# EAGLE design christmas_card (EAGLE 8.4.3)
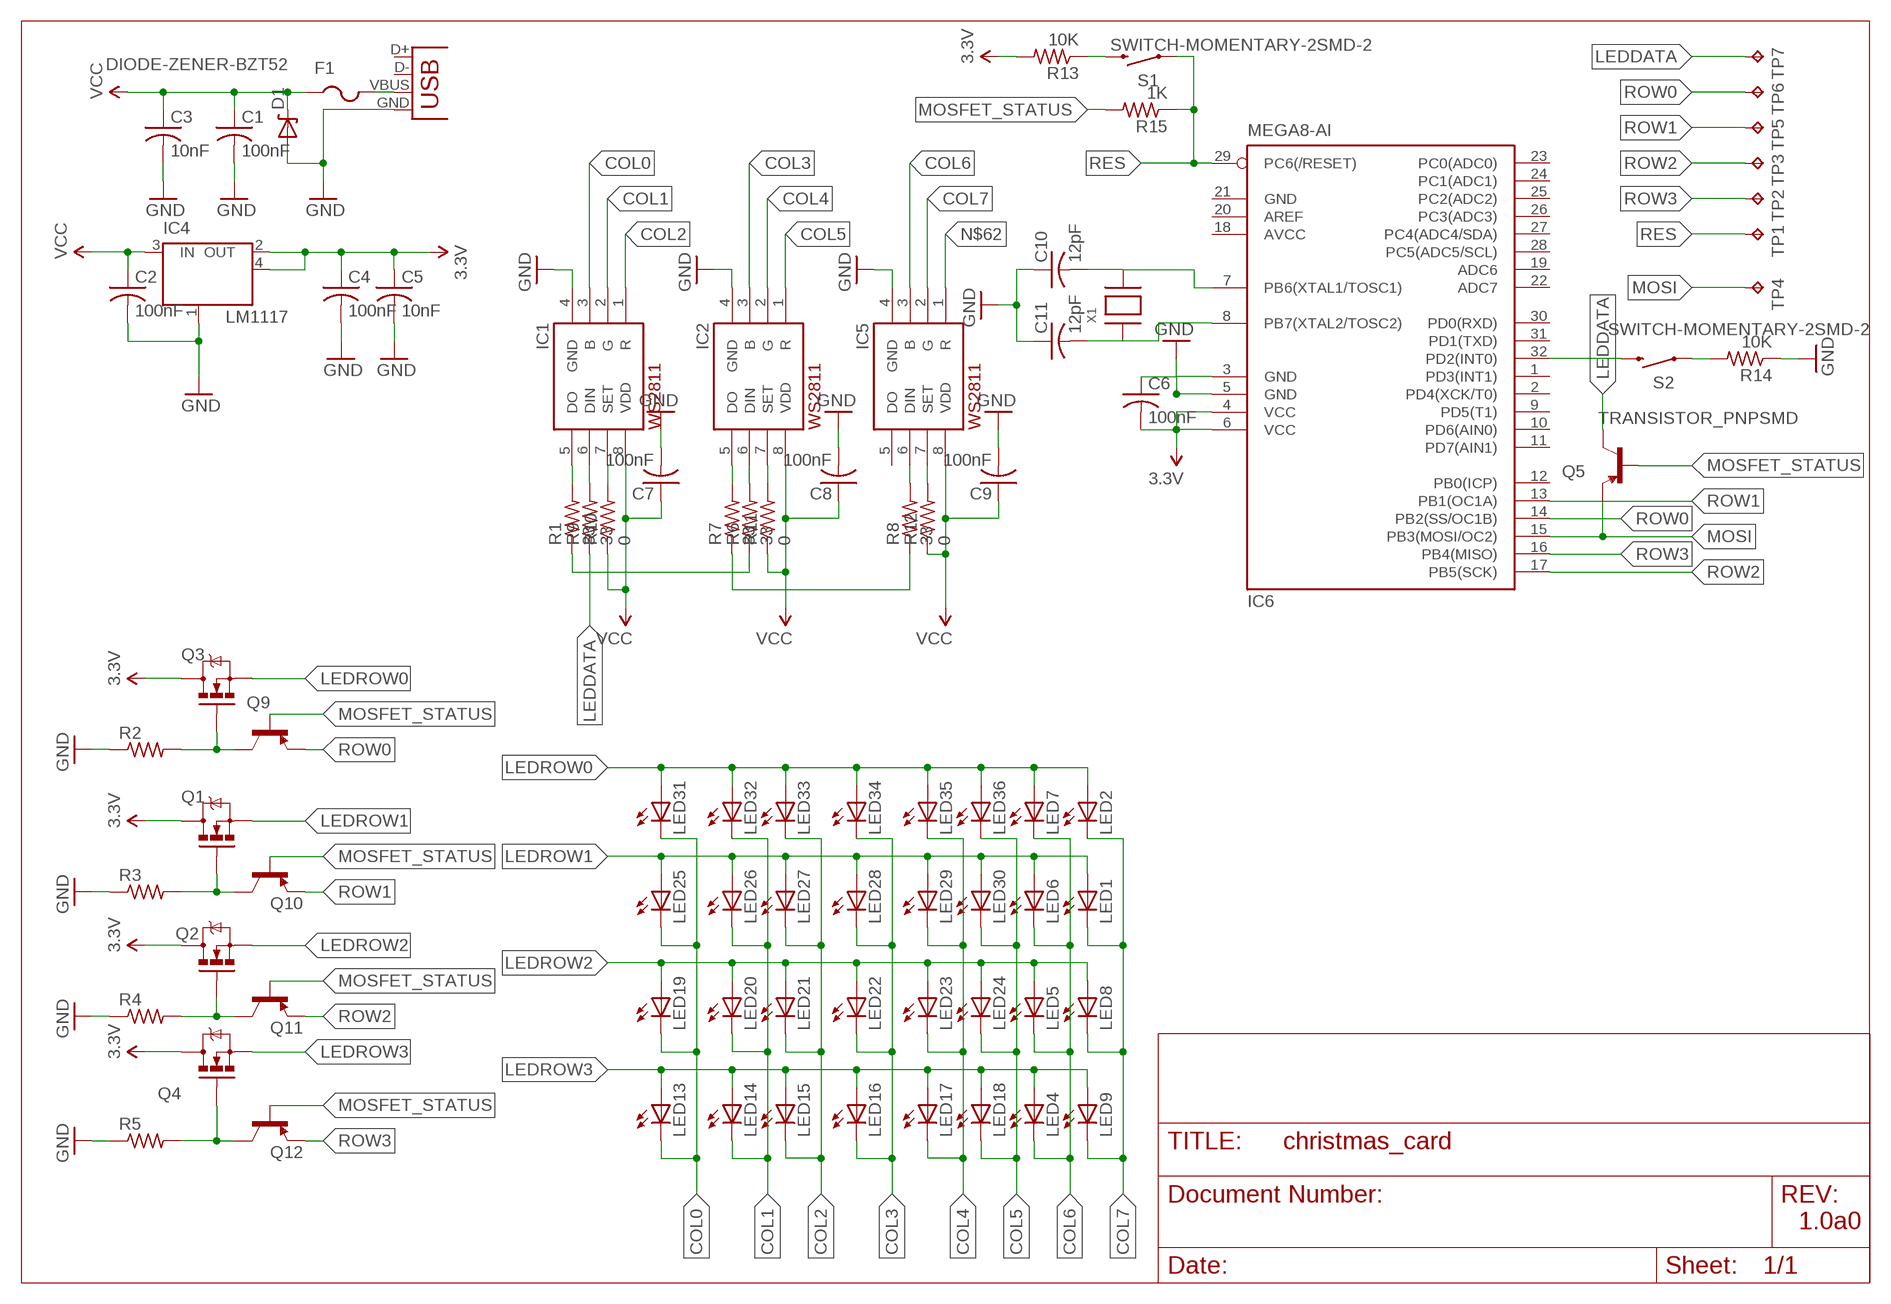
[diagram p0: schematic, sheet 1]

## Parts
C1  100nF  C-USC0603  [C0603]
C2  100nF  C-USC0603  [C0603]
C3  10nF  C-USC0603  [C0603]
C4  100nF  C-USC0603  [C0603]
C5  10nF  C-USC0603  [C0603]
C6  100nF  C-USC0603  [C0603]
C7  100nF  C-USC0603  [C0603]
C8  100nF  C-USC0603  [C0603]
C9  100nF  C-USC0603  [C0603]
C10  12pF  C-USC0603  [C0603]
C11  12pF  C-USC0603  [C0603]
D1  DIODE-ZENER-BZT52  [SOD-323]
F1  PTCFUSE-1206  [R1206]
IC1  WS2811-SOP8  [SO08-SKINNYPADS]
IC2  WS2811-SOP8  [SO08-SKINNYPADS]
IC4  LM1117  [SOT223]
IC5  WS2811-SOP8  [SO08-SKINNYPADS]
IC6  MEGA8-AI  [TQFP32-08]
LED1  LED1206  [LED-1206]
LED2  LED1206  [LED-1206]
LED4  LED1206  [LED-1206]
LED5  LED1206  [LED-1206]
LED6  LED1206  [LED-1206]
LED7  LED1206  [LED-1206]
LED8  LED1206  [LED-1206]
LED9  LED1206  [LED-1206]
LED13  LED1206  [LED-1206]
LED14  LED1206  [LED-1206]
LED15  LED1206  [LED-1206]
LED16  LED1206  [LED-1206]
LED17  LED1206  [LED-1206]
LED18  LED1206  [LED-1206]
LED19  LED1206  [LED-1206]
LED20  LED1206  [LED-1206]
LED21  LED1206  [LED-1206]
LED22  LED1206  [LED-1206]
LED23  LED1206  [LED-1206]
LED24  LED1206  [LED-1206]
LED25  LED1206  [LED-1206]
LED26  LED1206  [LED-1206]
LED27  LED1206  [LED-1206]
LED28  LED1206  [LED-1206]
LED29  LED1206  [LED-1206]
LED30  LED1206  [LED-1206]
LED31  LED1206  [LED-1206]
LED32  LED1206  [LED-1206]
LED33  LED1206  [LED-1206]
LED34  LED1206  [LED-1206]
LED35  LED1206  [LED-1206]
LED36  LED1206  [LED-1206]
Q1  MOSFET-NCHANNELSMD  [SOT23-3]
Q2  MOSFET-NCHANNELSMD  [SOT23-3]
Q3  MOSFET-NCHANNELSMD  [SOT23-3]
Q4  MOSFET-NCHANNELSMD  [SOT23-3]
Q5  TRANSISTOR_PNPSMD  [SOT23-3]
Q9  TRANSISTOR_PNPSMD  [SOT23-3]
Q10  TRANSISTOR_PNPSMD  [SOT23-3]
Q11  TRANSISTOR_PNPSMD  [SOT23-3]
Q12  TRANSISTOR_PNPSMD  [SOT23-3]
R1  33  R-US_R0603  [R0603]
R2  R-US_R0603  [R0603]
R3  R-US_R0603  [R0603]
R4  R-US_R0603  [R0603]
R5  R-US_R0603  [R0603]
R6  33  R-US_R0603  [R0603]
R7  33  R-US_R0603  [R0603]
R8  33  R-US_R0603  [R0603]
R9  33  R-US_R0603  [R0603]
R10  0  R-US_R0603  [R0603]
R11  0  R-US_R0603  [R0603]
R12  0  R-US_R0603  [R0603]
R13  10K  R-US_R0603  [R0603]
R14  10K  R-US_R0603  [R0603]
R15  1K  R-US_R0603  [R0603]
S1  SWITCH-MOMENTARY-2SMD-2  [TACTILE_SWITCH_SMD-2]
S2  SWITCH-MOMENTARY-2SMD-2  [TACTILE_SWITCH_SMD-2]
TP1  TPB1,27  [B1,27]
TP2  TPB1,27  [B1,27]
TP3  TPB1,27  [B1,27]
TP4  TPB1,27  [B1,27]
TP5  TPB1,27  [B1,27]
TP6  TPB1,27  [B1,27]
TP7  TPB1,27  [B1,27]
X1  XTALNX5032  [NX5032]
X2  USB-MICROB  [USB-MICROB]

## Nets
3.3V: C4.1 C5.1 C6.2 IC4.2(OUT) IC4.4(OUT) IC6.4(VCC) IC6.6(VCC) Q1.3(D) Q2.3(D) Q3.3(D) Q4.3(D) R13.2
COL0: IC1.3(B) LED13.C LED19.C LED25.C LED31.C
COL1: IC1.2(G) LED14.C LED20.C LED26.C LED32.C
COL2: IC1.1(R) LED15.C LED21.C LED27.C LED33.C
COL3: IC2.3(B) LED16.C LED22.C LED28.C LED34.C
COL4: IC2.2(G) LED17.C LED23.C LED29.C LED35.C
COL5: IC2.1(R) LED18.C LED24.C LED30.C LED36.C
COL6: IC5.3(B) LED4.C LED5.C LED6.C LED7.C
COL7: IC5.2(G) LED1.C LED2.C LED8.C LED9.C
GND: C1.2 C2.2 C3.2 C4.2 C5.2 C6.1 C7.2 C8.2 C9.2 C10.1 C11.1 D1.2(A) IC1.4(GND) IC2.4(GND) IC4.1(GND/ADJ) IC5.4(GND) IC6.3(GND) IC6.5(GND) R2.1 R3.1 R4.1 R5.1 R14.1 X2.GND
LEDDATA: Q5.3(C) R9.1 TP7.TP
LEDROW0: LED2.A LED7.A LED31.A LED32.A LED33.A LED34.A LED35.A LED36.A Q3.2(S)
LEDROW1: LED1.A LED6.A LED25.A LED26.A LED27.A LED28.A LED29.A LED30.A Q1.2(S)
LEDROW2: LED5.A LED8.A LED19.A LED20.A LED21.A LED22.A LED23.A LED24.A Q2.2(S)
LEDROW3: LED4.A LED9.A LED13.A LED14.A LED15.A LED16.A LED17.A LED18.A Q4.2(S)
MOSFET_STATUS: Q5.1(B) Q9.1(B) Q10.1(B) Q11.1(B) Q12.1(B) R15.2
MOSI: IC6.15(PB3(MOSI/OC2)) Q5.2(E) TP4.TP
N$1: R1.1 R6.1
N$2: IC1.5(DO) R1.2
N$3: IC2.6(DIN) R6.2
N$4: IC2.5(DO) R7.2
N$5: R7.1 R8.1
N$6: IC5.6(DIN) R8.2
N$7: IC1.6(DIN) R9.2
N$8: IC5.7(SET) R12.2
N$9: R13.1 S1.1
N$10: C10.2 IC6.7(PB6(XTAL1/TOSC1)) X1.P$2
N$11: IC6.32(PD2(INT0)) S2.1
N$12: R14.2 S2.2
N$13: Q3.1(G) Q9.3(C) R2.2
N$14: C11.2 IC6.8(PB7(XTAL2/TOSC2)) X1.P$1
N$35: IC2.7(SET) R11.2
N$36: IC1.7(SET) R10.2
N$41: F1.2 X2.VBUS
N$62: IC5.1(R)
RES: IC6.29(PC6(/RESET)) R15.1 S1.2 TP1.TP
ROW0: IC6.14(PB2(SS/OC1B)) Q9.2(E) TP6.TP
ROW1: IC6.13(PB1(OC1A)) Q1.1(G) Q10.2(E) Q10.3(C) R3.2 TP5.TP
ROW2: IC6.17(PB5(SCK)) Q2.1(G) Q11.2(E) Q11.3(C) R4.2 TP3.TP
ROW3: IC6.16(PB4(MISO)) Q4.1(G) Q12.2(E) Q12.3(C) R5.2 TP2.TP
VCC: C1.1 C2.1 C3.1 C7.1 C8.1 C9.1 D1.1(C) F1.1 IC1.8(VDD) IC2.8(VDD) IC4.3(IN) IC5.8(VDD) R10.1 R11.1 R12.1
Unconnected: IC5.5(DO) IC6.1(PD3(INT1)) IC6.2(PD4(XCK/T0)) IC6.9(PD5(T1)) IC6.10(PD6(AIN0)) IC6.11(PD7(AIN1)) IC6.12(PB0(ICP)) IC6.19(ADC6) IC6.20(AREF) IC6.22(ADC7) IC6.23(PC0(ADC0)) IC6.24(PC1(ADC1)) IC6.25(PC2(ADC2)) IC6.26(PC3(ADC3)) IC6.27(PC4(ADC4/SDA)) IC6.28(PC5(ADC5/SCL)) IC6.30(PD0(RXD)) IC6.31(PD1(TXD)) X2.D+ X2.D-

## Notes on the sheet
- 1.0a0

## Power pins joined to a net without a drawn wire
AVCC: IC6.18(AVCC)
GND: IC6.21(GND)

## Library data of the parts
C1-C11 = adafruit:C-US: CAPACITOR, American symbol
D1 = SparkFun:DIODE-ZENER: Zener Diode Production Part - 8199 3.4V Zener Voltage
F1 = adafruit:PTCFUSE: PTC fuses, resettable thermistors
IC1 IC2 IC5 = adafruit:WS2811
IC4 = voltage_regulators:LM1117
IC6 = atmel:MEGA8: MICROCONTROLLER 8 Kbytes FLASH, 1 kbytes SRAM, 512 bytes EEPROM, USART, 6-channel 10 bit ADC, 2-channel 8 bit ADC Pin compatible with Atmega48, ATMega88, ATMega168 Source: avr.lbr; MPN: ATMEGA8-16AU; OC_FARNELL: 9171371; OC_NEWARK: 73M8863
LED1 LED2 LED4-LED9 LED13-LED36 = SparkFun:LED: LEDs Standard schematic elements and footprints for 5mm, 3mm, 1206, and 0603 sized LEDs. 5mm - Spark Fun Electronics SKU : COM-00529 (and others)
Q1-Q4 = SparkFun:MOSFET-NCHANNEL
Q5 Q9-Q12 = SparkFun:TRANSISTOR_PNP
R1-R15 = adafruit:R-US_: RESISTOR, American symbol
S1 S2 = SparkFun:SWITCH-MOMENTARY-2
TP1-TP7 = testpad:TP: Test pad
X1 = adafruit:XTAL: Low cost SMT crystals, no capacitors included http://www.ladyada.net/library/eagle
X2 = SparkFun:USB: USB Connectors USB-B-PTH is fully proven SKU : PRT-00139 USB-miniB is fully proven SKU : PRT-00587 USB-A-PCB is untested. USB-A-H is throughly reviewed, but untested. Spark Fun Electronics SKU : PRT-00437 USB-B-SMT is throughly reviewed, but untested. Needs silkscreen touching up. USB-A-S has not been used/tested USB-MB-H has not been used/tested

## Board
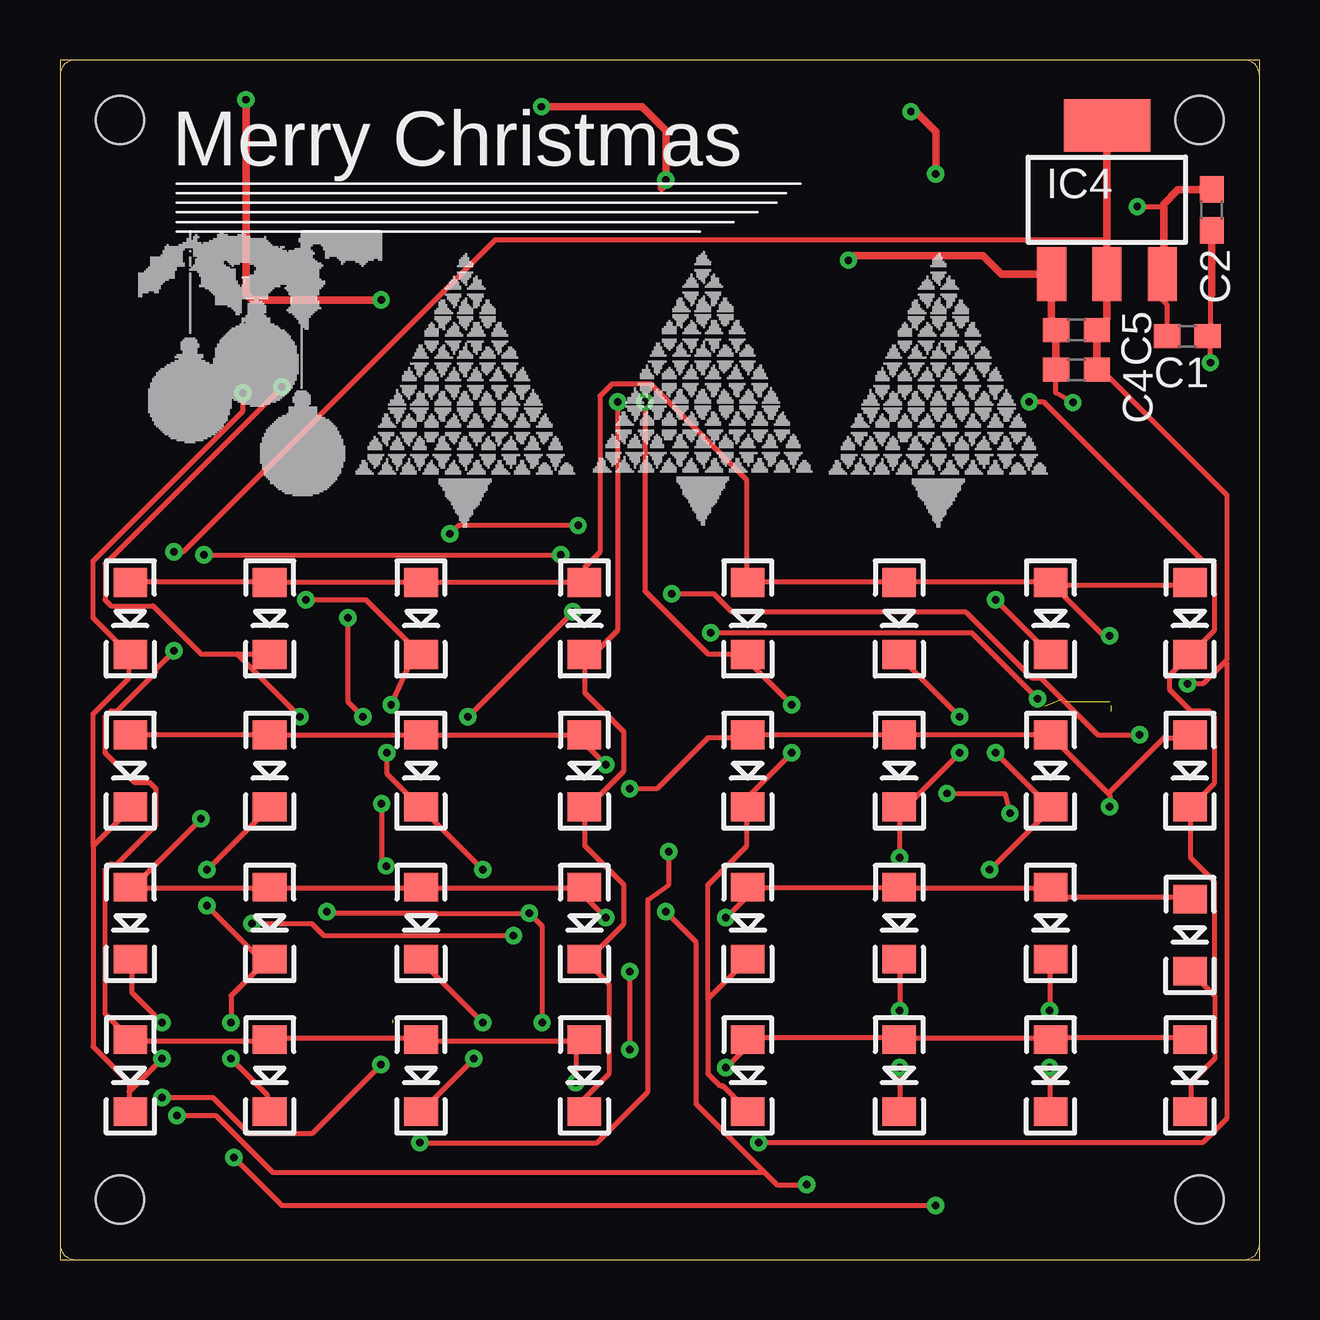
[diagram p1: board, top side]
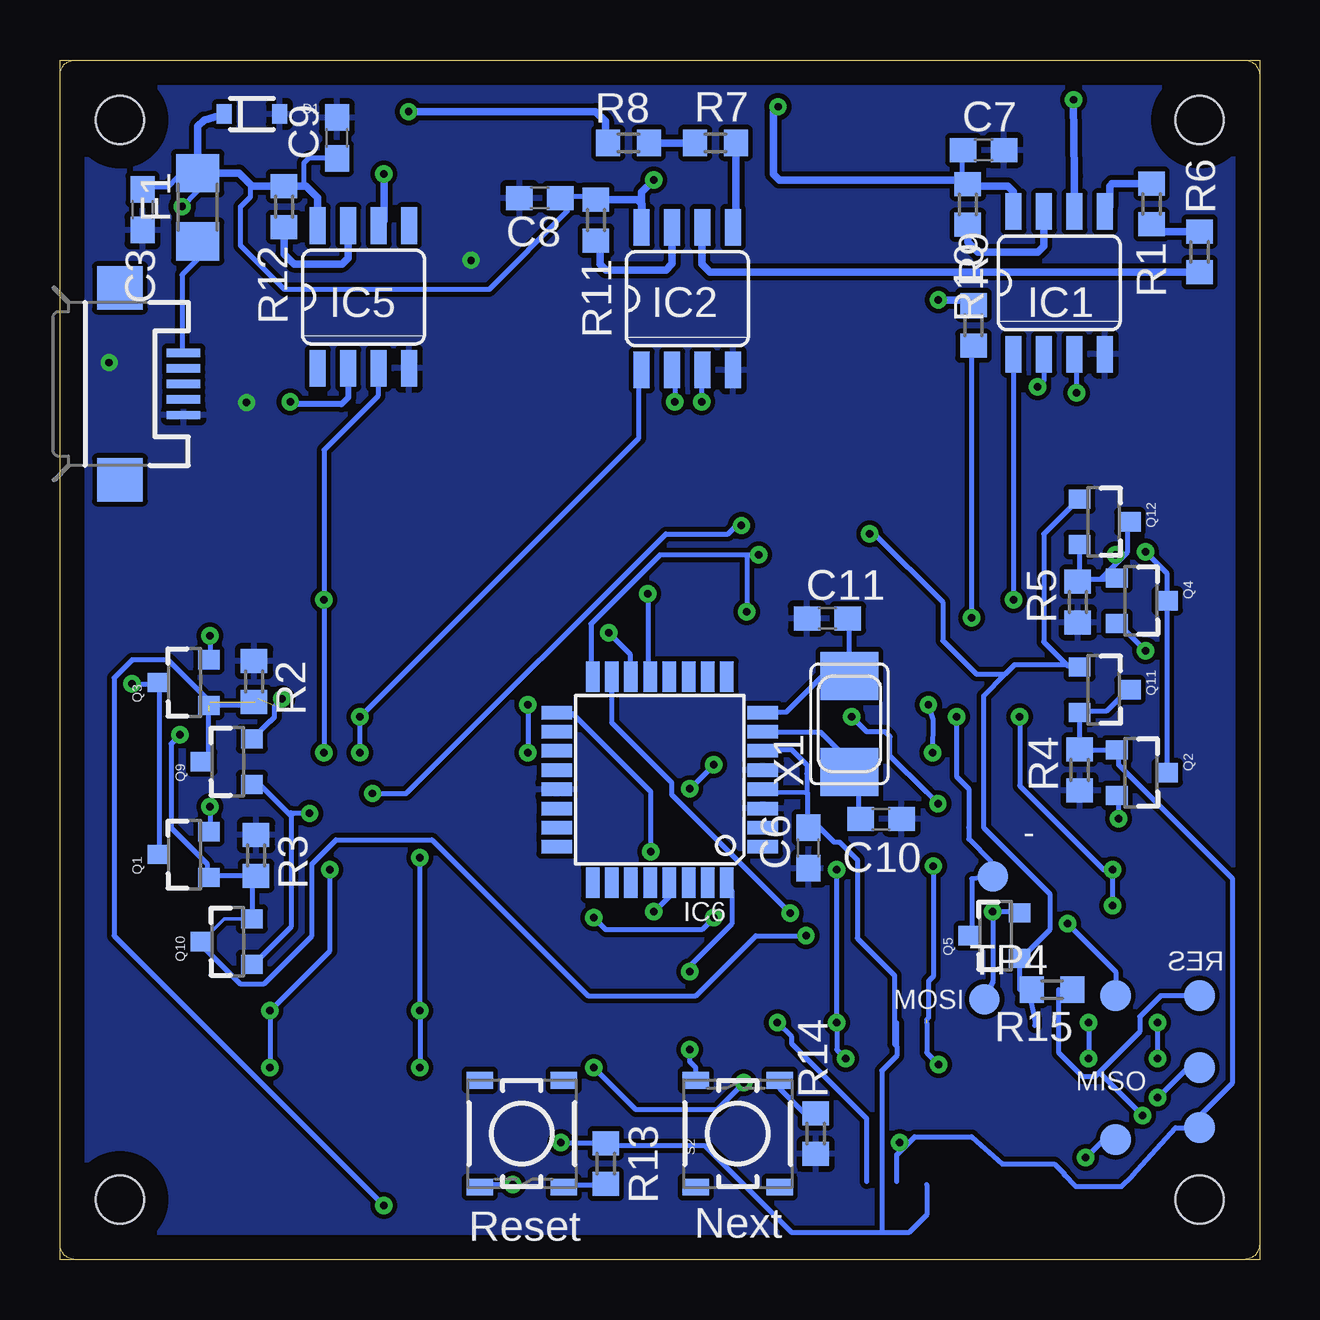
[diagram p2: board, bottom side, seen from below]

Size 50 x 50 mm. Coordinates in mm from the lower left corner, seen from the top.
Outline: 50,0.63 50,49.36 arc90 49.36,50 0.63,50 arc90 0,49.36 0,0.63 arc90 0.63,0 49.36,0 arc90 50,0.63
Outline: 0,0 50,0 50,50 0,50 0,0
Copper layers (1*16): Top 0.035mm / dielectric 1.5mm / Bottom 0.035mm
Design rules "default *": minimum track width 8mil, minimum drill 12mil, track to track 8mil, track to pad 8mil, pad to pad 8mil, via to via 8mil, smd to smd 8mil, copper to edge 40mil, drill to drill 8mil, minimum pad ring 10mil, minimum via ring 8mil, stop-mask expansion 4mil, vias tented up to drill 12mil, thermal gap 10mil
Holes 2 mm at 2.5,2.5 47.5,2.5 47.5,47.5 2.5,47.5

### Footprints (pad centres in the part's own frame; a part is rotated, then mirrored left to right if it is on the bottom)
C0603 = smd 1.1 x 1: 1 -0.85,0; 2 0.85,0
SOD-323 = smd 0.63 x 0.83: 1 -1.15,0; 2 1.15,0
R1206 = smd 1.6 x 1.803: 1 -1.422,0; 2 1.422,0
SO08-SKINNYPADS = smd 0.66 x 1.524: 1 -1.905,-2.973; 2 -0.635,-2.973; 3 0.635,-2.973; 4 1.905,-2.973; 5 1.905,2.973; 6 0.635,2.973; 7 -0.635,2.973; 8 -1.905,2.973
SOT223 = smd 1.219 x 2.235: 1 -2.311,-3.099; 2 0,-3.099; 3 2.311,-3.099 | smd 3.6 x 2.2: 4 0,3.099
TQFP32-08 = smd 1.27 x 0.559: 1 -4.293,2.8; 2 -4.293,2; 3 -4.293,1.2; 4 -4.293,0.4; 5 -4.293,-0.4; 6 -4.293,-1.2; 7 -4.293,-2; 8 -4.293,-2.8; 17 4.293,-2.8; 18 4.293,-2; 19 4.293,-1.2; 20 4.293,-0.4; 21 4.293,0.4; 22 4.293,1.2; 23 4.293,2; 24 4.293,2.8 | smd 0.559 x 1.27: 9 -2.8,-4.293; 10 -2,-4.293; 11 -1.2,-4.293; 12 -0.4,-4.293; 13 0.4,-4.293; 14 1.2,-4.293; 15 2,-4.293; 16 2.8,-4.293; 25 2.8,4.293; 26 2,4.293; 27 1.2,4.293; 28 0.4,4.293; 29 -0.4,4.293; 30 -1.2,4.293; 31 -2,4.293; 32 -2.8,4.293
LED-1206 = smd 1.2 x 1.4: A -1.5,0; C 1.5,0
SOT23-3 = smd 0.8 x 0.9: 1 -0.95,-1; 2 0.95,-1; 3 0,1.1
R0603 = smd 1 x 1.1: 1 -0.85,0; 2 0.85,0
TACTILE_SWITCH_SMD-2 = smd 0.7 x 1.1: 1 2.225,1.75; 2 2.225,-1.75; 3 -2.225,-1.75; 4 -2.225,1.75
B1,27 = smd 1.27 x 1.27: TP 0,0
NX5032 = smd 2 x 2.4: P$1 2,0; P$2 -2,0
USB-MICROB = smd 0.35 x 1.4: D+ 0,2.65; D- -0.65,2.65; GND 1.3,2.65; ID 0.65,2.65; VBUS -1.3,2.65 | smd 1.8 x 1.9: MT1 -4,0; MT2 4,0

### Placement (x,y rotation side)
C1  46.99,38.48 0 top
C2  48,43.75 270 top
C3  46.56,43.76 270 bottom
C4  42.37,37.09 180 top
C5  42.37,38.75 180 top
C6  18.8,17.16 90 bottom
C7  11.5,46.25 0 bottom
C8  30,44.25 180 bottom
C9  38.45,46.75 90 bottom
C10  15.77,18.37 180 bottom
C11  18.01,26.72 0 bottom
D1  42,47.75 0 bottom
F1  44.26,43.86 270 bottom
IC1  8.35,40.71 0 bottom
IC2  23.85,40.05 0 bottom
IC4  43.64,44.17 0 top
IC5  37.35,40.12 0 bottom
IC6  25,20 180 bottom
LED1  47.1,20.37 270 top
LED2  47.1,26.72 270 top
LED4  41.29,7.67 270 top
LED5  41.29,14.02 270 top
LED6  41.29,20.37 270 top
LED7  41.29,26.72 270 top
LED8  47.1,13.52 270 top
LED9  47.1,7.67 270 top
LED13  2.93,7.67 270 top
LED14  8.74,7.67 270 top
LED15  15.05,7.67 270 top
LED16  21.86,7.67 270 top
LED17  28.67,7.67 270 top
LED18  34.98,7.67 270 top
LED19  2.93,14.02 270 top
LED20  8.74,14.02 270 top
LED21  15.05,14.02 270 top
LED22  21.86,14.02 270 top
LED23  28.67,14.02 270 top
LED24  34.98,14.02 270 top
LED25  2.93,20.37 270 top
LED26  8.74,20.37 270 top
LED27  15.05,20.37 270 top
LED28  21.86,20.37 270 top
LED29  28.67,20.37 270 top
LED30  34.98,20.37 270 top
LED31  2.93,26.72 270 top
LED32  8.74,26.72 270 top
LED33  15.05,26.72 270 top
LED34  21.86,26.72 270 top
LED35  28.67,26.72 270 top
LED36  34.98,26.72 270 top
Q1  44.8,16.88 90 bottom
Q2  4.95,20.29 270 bottom
Q3  44.8,24.05 90 bottom
Q4  4.95,27.46 270 bottom
Q5  11,13.5 90 bottom
Q9  43,20.75 90 bottom
Q10  43,13.25 90 bottom
Q11  6.5,23.75 270 bottom
Q12  6.5,30.75 270 bottom
R1  4.5,44 90 bottom
R2  41.91,24.09 270 bottom
R3  41.83,16.84 270 bottom
R4  7.5,20.41 90 bottom
R5  7.58,27.41 90 bottom
R6  2.5,42 270 bottom
R7  22.68,46.54 0 bottom
R8  26.3,46.54 180 bottom
R9  11.92,38.94 90 bottom
R10  12.16,43.98 270 bottom
R11  27.66,43.32 270 bottom
R12  40.66,43.89 270 bottom
R13  27.25,4 90 bottom
R14  18.5,5.25 90 bottom
R15  8.65,11.25 180 bottom
S1  30.75,5.25 270 bottom
S2  21.75,5.25 90 bottom
TP1  2.5,11 0 bottom
TP2  2.5,8 0 bottom
TP3  2.5,5.5 0 bottom
TP4  11.47,10.85 0 bottom
TP5  6,11 0 bottom
TP6  6,5 0 bottom
TP7  11.11,15.97 0 bottom
X1  17.09,22.33 90 bottom
X2  47.5,36.5 270 bottom

### Tracks (layer width: path | path; a pad name or v marks a point on that pad's centre or on a via)
3.3V  (via drill 0.3)
  Top 0.203: v47,24 47.62,24 48.56,24.94 | 48.56,24.94 48.62,25 48.62,31.87 43.25,37.25 C4.1 | v4.75,29.5 5.12,29.5 18.12,42.5 43.64,42.5 | v29.12,4.87 47.62,4.87 48.62,5.87 48.62,24.87 48.56,24.94
  Top 0.305: IC4.4 43.64,42.5 IC4.2 43.64,39.17 C5.1 C4.1
  Bottom 0.2: 18.87,20.25 18.87,19.5 18.85,19.47 18.85,18.45 C6.2 18.74,18.41 17.73,17.4 17.5,17.4 16.76,16.66 16.76,13.39 15.21,11.84 15.21,8.98 15.12,8.89
  Bottom 0.203: 15.75,1.12 14.62,1.12 13.87,1.87 13.87,3.12 | 15.75,1.12 19.5,1.12 23.12,4.75 27.25,4.75 R13.2 27.25,4.87 v29.12,4.87 | 18.85,19.4 18.85,19.47 20.62,19.5 IC6.4 | 18.87,20.25 18.87,20.62 19.5,21.25 20.62,21.25 IC6.6 | 15.75,1.12 15.75,7.87 15.12,8.5 15.12,8.89 15.12,9.87 | Q2.3 3.87,20.37 3.87,27.37 Q4.3 3.87,27.5 3.87,28.62 v4.75,29.5 | Q1.3 45.87,17 45.87,24 Q3.3 46,24 v47,24
COL0  (via drill 0.3)
  Top 0.203: 2.87,7 2.87,7.37 1.37,8.87 1.37,17.25 1.44,17.31 | 2.87,7 2.87,6.25 LED13.C | 1.44,17.31 2.87,18.75 LED25.C | v4.25,9.87 3,11.12 3,12.5 LED19.C | 2.87,7 v4.25,8.37 | 1.44,17.31 1.37,17.37 1.37,22.75 2.87,24.25 2.87,25.12 LED31.C 2.87,25.25 1.37,26.75 1.37,29.12 7.62,35.37 v7.62,36.12
  Bottom 0.203: v4.25,8.37 v4.25,9.87 | v7.62,36.12 7.62,37.62 IC1.3
COL1  (via drill 0.3)
  Top 0.203: v7.12,8.37 8.62,6.87 8.62,6.25 LED14.C | v7.12,9.87 7.12,11 8.5,12.37 | 8.5,12.37 8.62,12.5 LED20.C 8.5,12.37 | v6.12,16.25 8.62,18.75 LED26.C | 8.5,12.37 v6.12,14.75 | 7.37,25.25 5.87,25.25 3.87,27.25 2.12,27.25 1.87,27.5 1.87,29 v9.25,36.37 | 7.37,25.25 8.62,25.25 LED32.C | 7.37,25.25 v10,22.62
  Bottom 0.203: v7.12,9.87 v7.12,8.37 | v6.12,14.75 v6.12,16.25 6.5,16.25 10,19.75 v10,22.62 | v9.25,36.37 9,36.62 9,37.62 IC1.2
COL2  (via drill 0.3)
  Top 0.2: v13.8,23.12 14.6,24.85 15,25.25
  Top 0.203: v17.25,8.37 15.12,6.25 LED15.C | v17.62,9.87 15,12.5 LED21.C | v17.62,16.25 15.12,18.75 LED27.C 15,18.87 13.62,20.25 v13.62,21.12 | 15,25.12 LED33.C 15,25.25 12.75,27.5 v10.25,27.5
  Bottom 0.203: v17.25,8.37 17.62,8.75 v17.62,9.87 v17.62,16.25 | v13.8,23.12 13.6,22.5 v13.62,21.12 | v10.25,27.5 10.25,37.62 IC1.1
COL3  (via drill 0.3)
  Top 0.203: LED16.C 21.87,6.25 21.87,6.75 22.87,7.75 22.87,11.5 21.87,12.5 LED22.C 22,12.5 23.5,14 23.5,15.62 21.87,17.25 21.87,18.75 | 21.87,24.87 21.87,23.62 23.5,22 23.5,20.37 21.87,18.75 | 21.87,24.87 21.87,25.12 LED34.C 21.87,24.87 | 21.87,18.75 LED28.C | v23.25,35.75 23.25,26.25 21.87,24.87
  Bottom 0.203: 23.16,36.98 IC2.3 23.25,37 v23.25,35.75
COL4  (via drill 0.3)
  Top 0.203: 27.06,10.94 28.62,12.5 LED23.C | 27.06,10.94 27,10.87 27,7.75 27.5,7.25 27.62,7.25 28.62,6.25 LED17.C | 27.06,10.94 27,11 27,15.62 28.62,17.25 28.62,18.75 LED29.C 28.75,18.87 28.75,19.37 v30.5,21.12 | 28.37,25.25 27,25.25 24.37,27.87 v24.37,35.75 | 28.37,25.25 28.62,25.25 LED35.C 28.37,25.25 | 28.37,25.25 v30.5,23.12
  Bottom 0.203: 24.59,36.98 IC2.2 | 24.62,37 IC2.2 | v24.37,35.75 24.37,37 IC2.2 | v30.5,23.12 v30.5,21.12
COL5  (via drill 0.3)
  Top 0.203: v35,8 35,6.25 LED18.C | v35,10.37 35,12.5 LED24.C | v35,16.75 35,18.62 | 35,18.62 35,18.75 LED30.C 35,18.62 | v37.5,22.62 35,25.12 LED36.C | 35,18.62 v37.5,21.12
  Bottom 0.203: 25.81,36.98 IC2.1 25.87,37 25.87,34.25 v37.5,22.62 v37.5,21.12 | v35,8 v35,10.37 v35,16.75
COL6  (via drill 0.3)
  Top 0.203: v41.25,8 41.25,6.25 LED4.C | v41.25,10.37 41.25,12.5 LED5.C | v38.75,16.25 41.25,18.75 LED6.C 41.25,18.87 v39,21.12 | v39,27.5 41.25,25.25 LED7.C
  Bottom 0.203: 36.78,36.98 IC5.3 | 36.87,37 IC5.3 | v41.25,8 v41.25,10.37 38.75,12.87 v38.75,16.25 | IC5.3 36.75,37 36.75,36 39,33.75 v39,27.5 v39,21.12
COL7  (via drill 0.3)
  Top 0.203: 48.06,11.06 47.12,12 LED8.C | 48.06,11.06 48.12,11 48.12,8.37 47.12,7.37 47.12,6.25 LED9.C | 48.06,11.06 48.12,11.12 48.12,15.75 47.12,16.75 47.12,18.75 LED1.C 47.12,18.87 48.12,19.87 48.12,22.62 47.87,22.87 47.12,22.87 46.25,23.75 46.25,24.37 47,25.12 LED2.C 47.12,25.25 48.12,26.25 48.12,29 48,29.12 47.62,29.12 41,35.75 v40.4,35.75
  Bottom 0.203: 38,37.12 IC5.2
  Bottom 0.254: IC5.2 37.98,35.93 38.27,35.65 40.3,35.65 v40.4,35.75
GND  (via drill 0.3)
  Top 0.203: 48,40.25 47.95,40.23 47.95,38.61 C1.2 47.95,38.4 v47.95,37.39 | v42.22,35.72 41.51,36.13 C4.2
  Top 0.305: C2.2 48,40.25 | C4.2 C5.2 41.33,38.94 IC4.1 39.24,41.07 38.47,41.85 33.07,41.85 v32.87,41.65
  Bottom 0.203: 18.38,4.52 18.5,4.5 R14.1 18.5,4
  pour Bottom: -1.27,50.8 70.82,50.55 70.82,-1.52 -1.27,-1.27
LEDDATA  (via drill 0.3)
  Top 0.203: v12,26.75 12,23.25 v12.62,22.62
  Bottom 0.2: 12.12,18 12.12,17.52 11.2,16.6 11.2,16.06 TP7.TP
  Bottom 0.203: Q5.3 12,13.5 12,15.87 TP7.TP | v12,26.75 12,38 R9.1 | v12.62,22.62 12.62,20.12 12.12,19.62 12.12,18
LEDROW0  (via drill 0.3)
  Top 0.203: LED31.A 3,28.25 8.62,28.25 LED32.A 8.75,28.25 15,28.25 LED33.A 15.12,28.25 21.75,28.25 LED34.A 21.87,28.25 21.87,28.87 22.5,29.5 22.5,36 23,36.5 24.62,36.5 28.62,32.5 28.62,28.25 LED35.A 28.75,28.25 34.87,28.25 LED36.A 35,28.25 41.25,28.25 LED7.A | v43.75,26 43.5,26 41.37,28.12 LED7.A | LED2.A 47,28.12 41.5,28.12 LED7.A
  Bottom 0.203: v43.75,26 43.75,25 Q3.2
LEDROW1  (via drill 0.3)
  Top 0.203: LED25.A 3,21.87 8.62,21.87 LED26.A 8.75,21.87 15,21.87 LED27.A 15.12,21.87 21.75,21.87 LED28.A 21.87,21.75 21.87,21.5 v22.75,20.62 | v43.75,18.87 43.75,19.37 43.69,19.44 | 43.69,19.44 41.37,21.75 LED6.A 41.25,21.87 35,21.87 LED30.A 34.87,21.87 28.75,21.87 LED29.A 28.62,21.75 27,21.75 24.87,19.62 v23.75,19.62 | 43.69,19.44 46,21.75 47,21.75 LED1.A
  Bottom 0.203: v43.75,18.87 43.75,17.87 Q1.2 | v23.75,19.62 v22.75,20.62
LEDROW2  (via drill 0.3)
  Top 0.203: LED8.A 47,15.12 41.75,15.12 41.37,15.5 LED5.A 41.25,15.5 35,15.5 LED24.A 34.87,15.5 28.75,15.5 LED23.A 28.62,15.5 28.62,15.12 v27.75,14.25 | v5.87,18.37 3,15.5 LED19.A 3.12,15.5 8.62,15.5 LED20.A 8.75,15.5 15,15.5 LED21.A 15.12,15.5 21.5,15.5 | 21.5,15.5 21.75,15.5 LED22.A 21.5,15.5 | 21.5,15.5 v22.75,14.25
  Bottom 0.203: v5.87,18.37 5.87,19.25 Q2.2 | v27.75,14.25 27.25,13.75 23.25,13.75 v22.75,14.25
LEDROW3  (via drill 0.3)
  Top 0.203: LED9.A 47,9.25 41.37,9.25 LED4.A 41.25,9.25 35,9.25 LED18.A 34.87,9.25 28.75,9.25 LED17.A 28.62,9.12 28.62,8.87 v27.75,8 | v4.75,25.37 4,24.62 4,24.5 2.37,22.87 2.12,22.87 1.87,22.62 1.87,21.12 3.12,19.87 3.75,19.87 4,19.62 4,18.12 2.37,16.5 2.12,16.5 1.87,16.25 1.87,10.25 2.87,9.25 LED13.A 3,9.12 8.62,9.12 LED14.A 8.75,9.25 15,9.25 LED15.A 15.12,9.12 21.5,9.12 | 21.5,9.12 21.75,9.12 LED16.A 21.5,9.12 | 21.5,9.12 v21.5,7.37
  Bottom 0.203: v4.75,25.37 5.87,26.5 Q4.2 | v27.75,8 26,6.25 22.62,6.25 v21.5,7.37
MOSFET_STATUS  (via drill 0.3)
  Top 0.2: v21.6,30.6 16.6,30.6 v16.25,30.25 | v36.97,19.42 39.37,19.42 v39.6,18.6
  Bottom 0.2: 24.75,30.25 22.15,30.25 21.8,30.6 v21.6,30.6 | v16.25,30.25 16.05,30.25 13.2,27.4 13.2,25.8 11.8,24.4 10.6,24.4 | 10.6,24.4 10.2,24.8 7.6,24.8 Q11.1 | 11.5,22.37 11.5,23.5 10.6,24.4 | v39.6,18.6 40.27,18.6 40.37,18.5 | v36.97,19.42 35.57,19.42 35.2,19.8
  Bottom 0.203: 40.44,18.56 41.62,19.75 42,19.75 Q9.1 | 40.44,18.56 40.37,18.5 40.37,13.87 41.87,12.37 42,12.37 Q10.1 | 9.37,9.75 9.37,10 9.52,10.75 9.52,11.25 | 9.52,11.25 10,11.25 Q5.1 10,12.62 9.87,12.62 8.75,13.75 8.75,15.25 11.5,18 11.5,22.37 | 9.52,11.25 R15.2 | Q11.1 7.5,24.75 8,24.75 9,25.75 9,30.25 7.5,31.75 Q12.1 | 35.2,19.8 24.75,30.25 | 16.16,30.1 v16.25,30.25 | 40.37,18.62 40.44,18.56
MOSI  (via drill 0.3)
  Top 0.2: 15.67,14.44 v19.56,14.44 20.1,13.9 v20.1,9.87 | 15.67,14.44 15.56,14.44 | 15.67,14.44 11.19,14.44 v11.12,14.5
  Bottom 0.2: 19.5,9 19.5,9.27 v20.1,9.87
  Bottom 0.203: 19.5,9 16.37,5.87 16.37,3.25 | Q5.2 10,14.5 v11.12,14.5 11.12,11.59 TP4.TP | IC6.15 27,22.37 24.5,19.87 24.5,19.37 v19.56,14.44 19.5,14.37
N$1
  Bottom 0.305: R6.1 4.2,42.85 R1.1
N$2
  Bottom 0.305: R1.2 6.15,44.85 6.25,44.75 6.25,43.88 IC1.5
N$3
  Bottom 0.305: R6.2 22.9,41.15 23.25,41.5 23.25,42.99 IC2.6
N$4
  Bottom 0.305: R7.2 21.83,43.14 IC2.5
N$5
  Bottom 0.305: R7.1 R8.1
N$6  (via drill 0.3)
  Top 0.305: v36.5,45.25 36.5,47.02 35.67,47.85 v35.47,47.85
  Bottom 0.2: v36.5,45.25
  Bottom 0.305: v36.5,45.25 36.5,43.31 IC5.6 | v35.47,47.85 27.67,47.85 27.27,47.45 27.27,46.66 R8.2
N$7  (via drill 0.3)
  Top 0.305: v7.75,48.35 7.75,40.25 8,40 v13.39,40
  Bottom 0.305: IC1.6 7.71,45.16 v7.75,48.35 | v13.39,40 11.71,40 R9.2
N$8
  Bottom 0.305: R12.2 40.66,41.91 40.25,41.5 38.25,41.5 38,41.75 38,43.08 IC5.7
N$9
  Bottom 0.203: R13.1 27.25,3.12 29,3.12 S1.1
N$10
  Bottom 0.2: C10.2 16.71,18.66 16.71,19.46 17.09,19.84 X1.P$2 17.09,20.78 18.29,21.97 20.68,21.97 IC6.7
N$11  (via drill 0.3)
  Top 0.2: v23.75,8.75 v23.75,12
  Bottom 0.2: S2.1 23.5,8 23.75,8.25 v23.75,8.75 | v23.75,12 23.75,12.25 23.5,12.5
  Bottom 0.203: 23.5,12.5 22,14 22,15.37 22.25,15.62 IC6.32
N$12
  Bottom 0.203: S2.2 20,7.12 19,6.12 18.5,6.12 R14.2
N$13  (1 unrouted)
  Bottom 0.203: Q9.3 43.8,21.05 43.8,22.84 | R2.2 42.05,23.1 Q3.1
N$14
  Bottom 0.2: IC6.8 19.74,22.81 18.22,24.33 X1.P$1 17.09,26.66 C11.2
N$35
  Bottom 0.305: IC2.7 24.48,41.51 24.75,41.25 27.25,41.25 27.5,41.5 27.5,42.31 R11.2
N$36
  Bottom 0.305: R10.2 12.16,42.41 11.75,42 9.25,42 9,42.25 9,43.67 IC1.7
N$41
  Bottom 0.203: X2.VBUS 44.91,37.79 44.91,41.05 44.3,41.66 44.3,42.27 F1.2
RES  (via drill 0.3)
  Top 0.203: v31.12,3.12 29.87,3.12 29.31,3.69 | 29.31,3.69 26.5,6.5 26.5,13.25 v25.25,14.5 | v4.87,6 6.5,6 8.87,3.62 29.25,3.62 29.31,3.69
  Bottom 0.203: 6.69,7.81 5,9.5 5,10.12 4.12,11 TP1.TP | 6.69,7.81 6.87,7.62 7.37,7.62 8.37,8.62 8.37,11.25 R15.1 | v31.12,3.12 32.5,3.12 S1.2 | v25.25,14.5 24.62,15.12 24.62,15.62 IC6.29 | v4.87,6 6.69,7.81
ROW0  (via drill 0.3)  (2 unrouted)
  Top 0.203: v27.12,26.12 38,26.12 v40.75,23.37 | v7.25,4.25 9.25,2.25 v36.5,2.25
  Bottom 0.203: v27.12,26.12 26.25,25.25 26.25,24.37 IC6.14 | 41.87,23.25 41.75,23.37 | v7.25,4.25 6.25,5.25 TP6.TP | v36.5,2.25 47.75,13.5 47.75,24.25 47,25 45.5,25 43.75,23.25 | v40.75,23.37 41.05,23.07 41.05,22.61 41.23,22.43 41.26,22.43 Q9.2
ROW1  (via drill 0.3)
  Top 0.203: v45,21.87 43.25,21.87 40.87,24.25 40.5,24.25 37.75,27 28,27 27.25,27.75 v25.5,27.75 | v8,14 10.5,14 11,13.5 v18.9,13.5
  Bottom 0.152: Q10.2 43.15,14.2 Q10.3
  Bottom 0.203: 44,13.25 Q10.3 44,13 42.5,11.5 41.5,11.5 39.5,13.5 39.5,16.5 38.5,17.5 34.5,17.5 28,11 23.5,11 21,13.5 v18.9,13.5 | 42,14.12 Q10.2 42,15.75 41.87,15.87 R3.2 41.87,16 43.75,16 Q1.1 43.87,16 43.87,16.5 45.37,18 45.37,21.5 v45,21.87 | v25.5,27.75 25.5,24.5 IC6.13 | TP5.TP 6,12 v8,14
ROW2  (via drill 0.3)
  Top 0.2: 24,6.5 24.5,7 24.5,15
  Top 0.203: v25.37,17 25.37,15.62 24.5,15 | 24,6.5 22.37,4.87 v15,4.87
  Bottom 0.203: Q11.3 5.5,23.75 6.37,22.87 7.5,22.87 Q11.2 R4.2 6,21.25 Q2.1 5.87,21.12 5.87,20.62 1.12,15.87 1.12,7.37 3,5.5 | 3,5.5 3.5,5.5 5.3,3.5 5.75,3.05 7.67,3.05 8.14,3.52 8.14,3.57 8.55,3.99 10.72,3.99 12,5.12 14.37,5.12 14.81,4.69 | 14.81,4.69 15.12,4.37 15.12,3.25 | v25.37,17 25.37,19.5 28.62,22.75 29.25,22.75 IC6.17 | 14.81,4.69 v15,4.87 | 3,5.5 TP3.TP
ROW3  (via drill 0.3)  (1 unrouted)
  Top 0.2: v13.4,19 13.4,16.6 v13.6,16.4
  Top 0.203: v4.25,6.75 6.37,6.75 7.87,5.25 10.5,5.25 v13.37,8.12 | v6,29.37 v20.87,29.37 | v21.37,27 v17,22.62
  Bottom 0.2: 13.87,19.5 13.87,19.47 | 13.87,19.47 v13.4,19 | v13.6,16.4 13.6,11.8 13.8,11.6 13.8,10.07 13.87,10 | 13.87,19.47 15.4,21 15.4,21.8 15.6,22 16.37,22 v17,22.62
  Bottom 0.203: TP2.TP 3,8 v4.25,6.75 | v13.37,8.12 13.87,8.62 13.87,9.87 | 7.5,28.37 6.62,28.37 | 6.62,28.37 6,28.37 Q4.1 | 7.5,28.37 Q12.2 | 7.5,28.37 R5.2 | 6.62,28.37 5.81,29.19 | 5.81,29.19 5.5,29.5 5.5,30.75 Q12.3 | v20.87,29.37 21.37,29.37 | 21.37,29.37 25,29.37 27.87,26.5 27.87,24.37 IC6.16 | 5.81,29.19 v6,29.37 | 21.37,29.37 v21.37,27
VCC  (via drill 0.3)
  Top 0.203: C1.1 46.13,38.61 46.13,39.83 45.52,40.44 IC4.3 | v44.91,43.89 46,43.89
  Top 0.305: IC4.3 45.56,40.68 45.56,40.5 46,40.94 46,43.89 46,44 46.6,44.6 C2.1 | v20.07,48.05 24.27,48.05 25.27,47.05 25.27,44.85 25.07,44.65 25.07,44.82 v25.25,45
  Bottom 0.203: 39.75,44.75 39.83,44.7 39.83,45.71 39.62,45.92 38.87,45.92 C9.1 | 44.3,45.11 45.11,45.11 45.52,44.7 46.53,44.7 C3.1 | v44.91,43.89 44.3,44.5 44.3,45.11 | 44.3,45.11 F1.1 | C7.1 12.39,46.13 12.39,45.11 R10.1 | 28.85,44.3 27.84,44.3 R11.1 | 28.85,44.3 29.06,44.3 C8.1 28.85,44.3 | 28.85,44.3 28.85,43.69 32.11,40.44 40.64,40.44 42.47,42.27 42.47,43.89 42.06,44.3 42.06,44.7 42,44.75
  Bottom 0.305: IC1.8 10.25,44.5 10.5,44.75 12.08,44.75 R10.1 12.33,45 20.02,45 20.27,45.25 20.27,47.85 v20.07,48.05 | R11.1 25.92,44.17 25.75,44 IC2.8 25.75,44.49 v25.25,45 | IC5.8 39.25,44.25 39.75,44.75 40.65,44.75 R12.1 40.67,44.75 42,44.75 42.53,45.28 F1.1 44.26,47.24 44,47.5 D1.1

### Text on the board
tPlace: Merry Christmas
bPlace: RES | MOSI | MISO | Next | Reset